# Altium schematic sheet 03-AD9546_EdgeConnections_EEPROM.SchDoc
size A; SheetNumber: 6; SheetTotal: 16
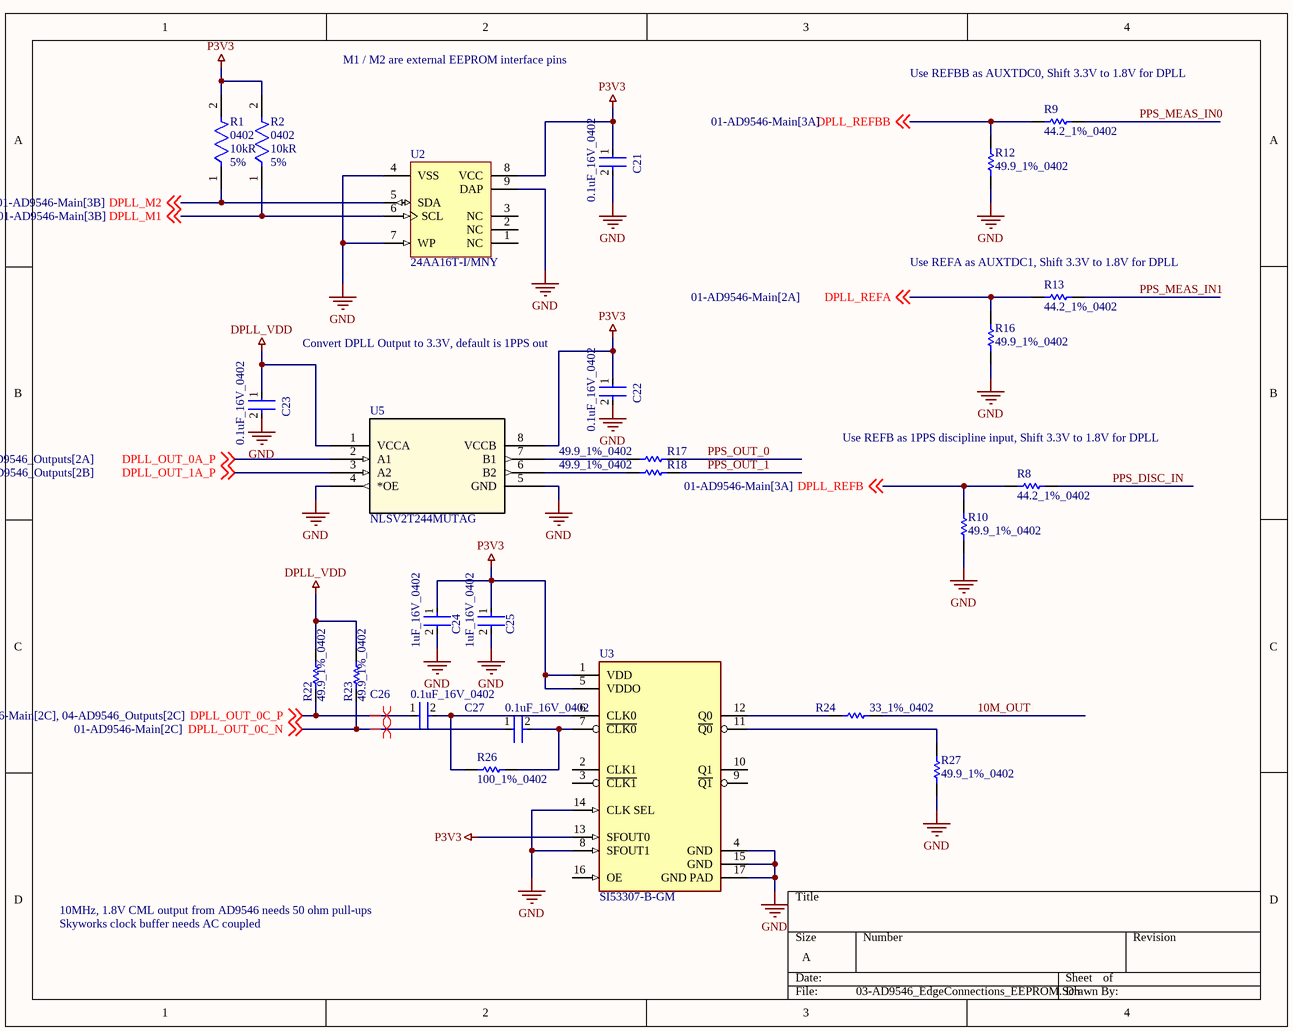
[diagram p0: 03-AD9546_EdgeConnections_EEPROM.SchDoc]

## Parts
C21  0.1uF_16V_0402  [FP-GRM15-MFG]
C22  0.1uF_16V_0402  [FP-GRM15-MFG]
C23  0.1uF_16V_0402  [FP-GRM15-MFG]
C24  1uF_16V_0402  [FP-0402-L_1_0_0_05-W_0_5-IPC_C]
C25  1uF_16V_0402  [FP-0402-L_1_0_0_05-W_0_5-IPC_C]
C26  0.1uF_16V_0402  [FP-GRM15-MFG]
C27  0.1uF_16V_0402  [FP-GRM15-MFG]
R1  Case/Package: 0402  Resistance: 10kR  Tolerance: 5%  [FP-CRCW0402-e3-IPC_B]  (hidden comment: CRCW040210K0JNED)
R2  Case/Package: 0402  Resistance: 10kR  Tolerance: 5%  [FP-CRCW0402-e3-IPC_B]  (hidden comment: CRCW040210K0JNED)
R8  44.2_1%_0402  [RESC1005X40X25LL05T05]
R9  44.2_1%_0402  [RESC1005X40X25LL05T05]
R10  49.9_1%_0402  [RESC1005X40X25NL05T05]
R12  49.9_1%_0402  [RESC1005X40X25NL05T05]
R13  44.2_1%_0402  [RESC1005X40X25LL05T05]
R16  49.9_1%_0402  [RESC1005X40X25NL05T05]
R17  49.9_1%_0402  [RESC1005X40X25NL05T05]
R18  49.9_1%_0402  [RESC1005X40X25NL05T05]
R22  49.9_1%_0402  [RESC1005X40X25NL05T05]
R23  49.9_1%_0402  [RESC1005X40X25NL05T05]
R24  33_1%_0402  [RESC1005X40X25LL05T10]
R26  100_1%_0402  [RESC1005X40X25ML05T10]
R27  49.9_1%_0402  [RESC1005X40X25NL05T05]
U2  24AA16T-I/MNY  [TDFN-MN8]
U3  SI53307-B-GM  [FP-SI53307-B-GM-MFG]
U5  NLSV2T244MUTAG  [UDFN8_1P20X1P80_ONS]

## Nets
DPLL_VDD: C23.1 R22.1 R23.1 U5.1(VCCA)
GND: C21.2 C22.2 C23.2 C24.2 C25.2 R10.1 R12.1 R16.1 R27.2 U2.4(VSS) U2.7(WP) U2.9(DAP) U3.4(GND) U3.8(SFOUT1) U3.14(CLK_SEL) U3.15(GND) U3.17(GND_PAD) U5.4(*OE) U5.5(GND)
P3V3: C21.1 C22.1 C24.1 C25.1 R1.2 R2.2 U2.8(VCC) U3.1(VDD) U3.5(VDDO) U3.13(SFOUT0) U5.8(VCCB)
10M_OUT: R24.2
DPLL_M1: R2.1 U2.6(SCL) ; off-sheet DPLL_M1
DPLL_M2: R1.1 U2.5(SDA) ; off-sheet DPLL_M2
DPLL_OUT_0A_P: U5.2(A1) ; off-sheet DPLL_OUT_0A_P
DPLL_OUT_0C_N: C27.1 R23.2 ; off-sheet DPLL_OUT_0C_N
DPLL_OUT_0C_P: C26.1 R22.2 ; off-sheet DPLL_OUT_0C_P
DPLL_OUT_1A_P: U5.3(A2) ; off-sheet DPLL_OUT_1A_P
DPLL_REFA: R13.1 R16.2 ; off-sheet DPLL_REFA
DPLL_REFB: R8.1 R10.2 ; off-sheet DPLL_REFB
DPLL_REFBB: R9.1 R12.2 ; off-sheet DPLL_REFBB
PPS_DISC_IN: R8.2
PPS_MEAS_IN0: R9.2
PPS_MEAS_IN1: R13.2
PPS_OUT_0: R17.1
PPS_OUT_1: R18.1
NetC26_2: C26.2 R26.1 U3.6(CLK0)
NetC27_2: C27.2 R26.2 U3.7(~{CLK0})
NetR17_2: R17.2 U5.7(B1)
NetR18_2: R18.2 U5.6(B2)
NetR24_1: R24.1 U3.12(Q0)
NetR27_1: R27.1 U3.11(~{Q0})

Not connected (* = marked no-connect by the designer): U2 1(NC) 2(NC) 3(NC); U3 2(CLK1) 3(~{CLK1}) 9(~{Q1}) 10(Q1) 16(OE)

## Layout directives
differential pair: DPLL_OUT_0C_N, DPLL_OUT_0C_P

## Notes on the sheet
- M1 / M2 are external EEPROM interface pins
- (near R9) Use REFBB as AUXTDC0, Shift 3.3V to 1.8V for DPLL
- (near R13) Use REFA as AUXTDC1, Shift 3.3V to 1.8V for DPLL
- Convert DPLL Output to 3.3V, default is 1PPS out
- (near R8) Use REFB as 1PPS discipline input, Shift 3.3V to 1.8V for DPLL
- 10MHz, 1.8V CML output from AD9546 needs 50 ohm pull-ups
- Skyworks clock buffer needs AC coupled

## Library data of the parts
C21-C23 C26 C27 = CMP-2100-03641-2: CAP CER 0.1UF 16V X7R 0402; Manufacturer Part Number: GRM155R71C104KA88D; Manufacturer: Murata; Standoff Height: 0mm; Tolerance: 10%; Voltage Rating: 16Vdc; Material: Ceramic; Capacitance: 0.10μF; Value: 0.10μF; RoHS: TRUE; Temperature Characteristic: X7R; Octopart: https://octopart.com/grm155r71c104ka88d-murata-196880; Digikey Description: CAP CER 0.1UF 16V X7R 0402; Device Class L3: Ceramic Capacitors; Height: 0.55mm; ComponentLink2Description: Datasheet; Temperature Range Low: -55°C; Ipc Land Pattern Name: CAPC10050X219; ComponentLink2URL: https://search.murata.co.jp/Ceramy/image/img/A01X/G101/ENG/GRM155R71H471KA01-01A.pdf; Device Class L1: Passive Components; Lead Free: yes; Category: Cap; Package: GRM15; Temperature: -55°C to +125°C; Device Class L2: Capacitors; Temperature Range High: +125°C; Mouser Description: 0402 0.1 uF 16V ±10 % Tolerance X7R SMT Multilayer Ceramic Capacitor
C24 C25 = CMP-14477-003537-2: None; Tolerance: 20%; Voltage Rating (DC): 16V; Capacitance: 1uF; Dielectric: X5R; Height: 0.5mm; Package Quantity: 10000; Series: M; Max Operating Temperature: 85°C; Width: 0.02inch; Mount: Surface Mount; Thickness: 0.022inch; Length: 1mm; Min Operating Temperature: -55°C; Depth: 0.5mm; RoHS Compliant: Yes; Construction: Flat; Case/Package: 0402; Radiation Hardening: No; Packaging: Tape and Reel; Voltage: 16V; Voltage Rating: 16V; Halogen Free: Halogen Free
R1 R2 = CMP-2002-08136-3: RES Thick Film, 10kΩ, 5%, 0.063W, 200ppm/°C, 0402; Voltage Rating: 50V; Power Rating: 63mW; Military Standard: Not; Packaging: Tape and Reel; Case Code (Imperial): 0402; Min Operating Temperature: -55°C; Case Code (Metric): 1005; Temperature Coefficient: 200ppm/°C; Termination: SMD/SMT; Composition: Thick Film; Depth: 0.5mm; Number of Terminations: 2; Contact Plating: Tin; Height: 0.016inch; Width: 0.5mm; Max Operating Temperature: 155°C; Features: Automotive AEC-Q200; Length: 1mm; Radiation Hardening: No; Max Power Dissipation: 63mW; Mount: Surface Mount; Package Quantity: 1; Weight: 2.3E-05oz
R8 R9 R13 = CMP-2002-00011-1: Manufacturer: Vishay Dale; Part Number: CRCW040244R2FKED
R10 R12 R16-R18 R22 R23 R27 = CMP-2002-00969-1: Manufacturer: Panasonic; Part Number: ERJ-2RKF49R9X
R24 = CMP-2002-07619-1: Part Number: RC0402FR-0733RL; Manufacturer: Yageo / Phycomp
R26 = CMP-2002-07344-1: Part Number: RC0402FR-07100RL; Manufacturer: Yageo / Phycomp
U2 = CMP-0159-00483-1: 16Kbit, 400kHz, 1.7V, I2C Serial EEPROM, 8-Pin TDFN (NiPdAu finish), Industrial Temperature, Tape and Reel; PackageReference: TDFN-MN8; PackageVersion: revBB, Aug-2009; PackageDescription: 8-Lead Plastic Dual Flat, No Lead Package (MN) - 2x3x0.75mm Body [TDFN]; DatasheetVersion: revJ, Oct-2009
U3 = CMP-08071-000001-1: IC CLK BUFFER 2:4 725MHZ 16QFN; Manufacturer: Silicon Labs; Number Of Inputs: 2; Standoff Height: 0mm; Number Of Outputs: 4; Max Junction Temp: +125°C; Description: Clock Fanout Buffer (Distribution), Multiplexer IC 2:4 725MHz 16-VFQFN Exposed Pad; Min Supply Voltage: 1.71V; Number Of Elements: 1; Nominal Supply Current: 65mA; Max Supply Voltage: 3.63V; Logic Function: Non-Inverting; Propagation Delay: 875ps; Manufacturer Part Number: SI53307-B-GM; Ambient Temperature Range High: +85°C; Device Class L2: Clock and Timing; Temperature: -40°C to +85°C; Automotive: No; Height: 0.9mm; Package: 0; ComponentLink2URL: https://www.silabs.com/documents/public/data-sheets/si5330x-datasheet.pdf; ComponentLink2Description: Datasheet; Temperature Range High: +85°C; Category: IC; Ambient Temperature Range Low: -40°C; Device Class L1: Integrated Circuits (ICs); Octopart: https://octopart.com/si53307-b-gm-silicon+labs-51374320; Mouser Description: Clock Buffer 1:2 Univ bufr/Lvl Trans 725MHz; Temperature Range Low: -40°C; Device Class L3: Clock Buffers; Ipc Land Pattern Name: QFN50P300X300X85-16; RoHS: TRUE; Digikey Description: IC CLK BUFFER 2:4 725MHZ 16QFN; Lead Free: Yes
U5 = NLSV2T244MUTAG: No Description Available; Mfr_Name: onsemi; Copyright: Copyright (C) 2023 Ultra Librarian. All rights reserved.; Manufacturer_Part_Number: NLSV2T244MUTAG; RefDes: RefDes; Type: DEV